# Altium project s-radio.PrjPcb
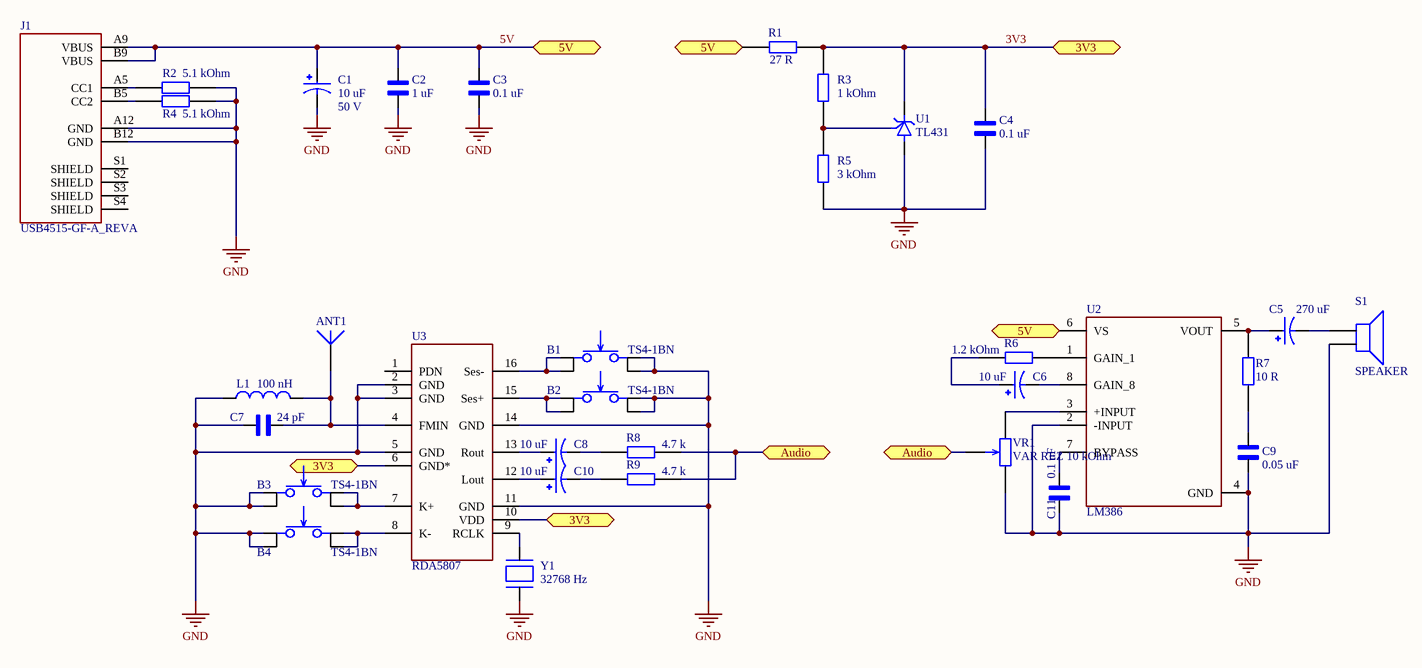
[diagram p0: s-radio_SCHEM.SchDoc]
1 sheet, 33 parts. Net scope: flat (ports and power ports of the same name join across sheets).
Board file: s-radio_PCB.PcbDoc

## Sheet s-radio_SCHEM.SchDoc
size A3; SheetNumber: 1; SheetTotal: 1

### Parts
ANT1  Antenna  [Antenna]  (value not drawn)
B1  TS4-1BN  [TS4-1BN]
B2  TS4-1BN  [TS4-1BN]
B3  TS4-1BN  [TS4-1BN]
B4  TS4-1BN  [TS4-1BN]
C1  value 10 uF  Voltage: 50 V  [К50-35 5x7]  (hidden comment: К50-35)
C2  value 1 uF  [CAP_0603]  (hidden comment: CAP 0603 1 uF)
C3  value 0.1 uF  [CAP_0603]  (hidden comment: CAP 0603 0.1 uF)
C4  value 0.1 uF  [CAP_0603]  (hidden comment: CAP 0603 0.1 uF)
C5  value 270 uF  [CAPPRD350W60D800H1500]  (hidden comment: CAP 270 uF)
C6  value 10 uF  [К50-35 5x7]  (hidden comment: К50-35)
C7  value 24 pF  [CAP_0805]  (hidden comment: CAP 0805 24 pF)
C8  value 10 uF  [К50-35 5x7]  (hidden comment: К50-35)
C9  value 0.05 uF  [CAP_1206]  (hidden comment: CAP 0.05uF 1206)
C10  value 10 uF  [К50-35 5x7]  (hidden comment: К50-35)
C11  value 0.1 uF  [CAP_0603]  (hidden comment: CAP 0603 0.1 uF)
J1  USB4515-GF-A_REVA  [GCT_USB4515-GF-A_REVA]
L1  value 100 nH  [L_0805]  (hidden comment: LQW2BASR10J00L)
R1  value 27 R  [RES_2512]  (hidden comment: RES 27 Ohm)
R2  value 5.1 kOhm  [RES_0603]  (hidden comment: RES 5.1 kOhm)
R3  value 1 kOhm  [RES_0603]  (hidden comment: RES 1 kOhm)
R4  value 5.1 kOhm  [RES_0603]  (hidden comment: RES 5.1 kOhm)
R5  value 3 kOhm  [RES_0603]  (hidden comment: RES 3 kOhm)
R6  value 1.2 kOhm  [RES_0603]  (hidden comment: RES 1.2 kOhm)
R7  value 10 R  [RES_0603]  (hidden comment: RES 10 R)
R8  value 4.7 k  [RES_0805]  (hidden comment: RES 4.7 kOhm)
R9  value 4.7 k  [RES_0805]  (hidden comment: RES 4.7 kOhm)
S1  SPEAKER  [SPEAKER]
U1  TL431  [SOT95P237X112-3N]
U2  LM386  [dip-8]
U3  RDA5807  [SOP-16]
VR1  VAR REZ 10 kOhm  [P160]
Y1  value 32768 Hz  [XTAL_NX3215SA-32.768K-STD-MUA-8]  (hidden comment: NX3215SA-32.768K-STD-MUA-8)

### Ports
3V3 (bidir, see s-radio_SCHEM[2B], s-radio_SCHEM[3B]), 3V3 (bidir, see s-radio_SCHEM[2B], s-radio_SCHEM[5A]), 3V3 (bidir, see s-radio_SCHEM[3B], s-radio_SCHEM[5A]), 5V (bidir, see s-radio_SCHEM[3A]), 5V (bidir, see s-radio_SCHEM[3A], s-radio_SCHEM[5B]), Audio (bidir, see s-radio_SCHEM[4B])

### Nets
GND: B1.3 B1.4 B2.3 B2.4 B3.1 B3.2 B4.1 B4.2 C1.N C2.1 C3.1 C4.1 C7.1 C9.1 C11.2 J1.A12(GND) J1.B12(GND) L1.1 R2.2 R4.2 R5.1 S1.2 U1.2(A) U2.2(-INPUT) U2.4(GND) U3.2(GND) U3.3(GND) U3.5(GND) U3.11(GND) U3.14(GND) VR1.1 Y1.1
3V3: C4.2 R1.2 R3.2 U1.3(C) U3.6(GND*) U3.10(VDD) ; port 3V3
5V: C1.P C2.2 C3.2 J1.A9(VBUS) J1.B9(VBUS) R1.1 U2.6(VS) ; port 5V
NetANT1_1: ANT1.1 C7.2 L1.2 U3.4(FMIN)
NetB1_1: B1.1 B1.2 U3.16(Ses-)
NetB2_1: B2.1 B2.2 U3.15(Ses+)
NetB3_3: B3.3 B3.4 U3.7(K+)
NetB4_3: B4.3 B4.4 U3.8(K-)
NetC5_N: C5.N S1.1
NetC5_P: C5.P R7.2 U2.5(VOUT)
NetC6_N: C6.N U2.8(GAIN_8)
NetC6_P: C6.P R6.1
NetC8_N: C8.N R8.1
NetC8_P: C8.P U3.13(Rout)
NetC9_2: C9.2 R7.1
NetC10_N: C10.N R9.1
NetC10_P: C10.P U3.12(Lout)
NetC11_1: C11.1 U2.7(BYPASS)
NetJ1_A5: J1.A5(CC1) R2.1
NetJ1_B5: J1.B5(CC2) R4.1
NetR3_1: R3.1 R5.2 U1.1(REF)
NetR6_2: R6.2 U2.1(GAIN_1)
NetR8_2: R8.2 R9.2 VR1.2 ; port Audio
NetU2_3: U2.3(+INPUT) VR1.3
NetU3_9: U3.9(RCLK) Y1.2

Not connected (* = marked no-connect by the designer): J1 S1(SHIELD) S2(SHIELD) S3(SHIELD) S4(SHIELD); U3 1(PDN)

### Library data of the parts
C1 C6 C8 C10 = К50-35: 10 uF 50V Aluminum Electrolytic Capacitors Radial; MP: К50-35; Availability: In Stock
  C6 C8 C10: Voltage: 50 V
C5 = CAP 270 uF: 270ÂµF 35V Aluminum Electrolytic Capacitors Radial, Can 8000 Hrs @ 105Â°C; MP: EEUFR1V271L; MF: Panasonic; Package: RADIAL-2 Panasonic; Check_prices: https://www.snapeda.com/parts/EEUFR1V271L/Panasonic/view-part/5793680/?ref=eda; SnapEDA_Link: https://www.snapeda.com/parts/EEUFR1V271L/Panasonic/view-part/5793680/?ref=snap; Digi-Key_Part_Number: P15388CT-ND
C7 = CAP 0805 24 pF: MP: GRM2165C1H240J; Package: 0805; Price: None; Availability: Unavailable; Link: https://www.chipdip.ru/product/grm2165c1h240j
C9 = CAP 0.05uF 1206: Ceramic Capacitor 0.05uf, 50v, X7r, 5%, 1206, Full Reel; MP: 12065C503JAT2A; MF: AVX; Digi-Key_Part_Number: 478-12065C503JAT2ACT-ND; Check_prices: https://www.snapeda.com/parts/12065C503JAT2A/AVX/view-part/2779742/?ref=eda; SnapEDA_Link: https://www.snapeda.com/parts/12065C503JAT2A/AVX/view-part/2779742/?ref=snap; Purchase-URL: https://pricing.snapeda.com/search/part/12065C503JAT2A/?ref=eda; Package: 1206; ComponentLink1Description: New link; ComponentLink1URL: *; Link: https://www.chipdip.ru/product0/9001260404
J1 = USB4515-GF-A_REVA: Type C USB Charging Connector; MF: Global Connector Technology; SnapEDA_Link: https://www.snapeda.com/parts/USB4515-GF-A/Global+Connector+Technology/view-part/?ref=snap; Package: None; Check_prices: https://www.snapeda.com/parts/USB4515-GF-A/Global+Connector+Technology/view-part/?ref=eda; Value: *; Digi-Key_Part_Number: 2073-USB4515-GF-ATR-ND; MP: USB4515-GF-A
L1 = LQW2BASR10J00L: Ind RF Chip Wirewound 100nH 5% 150MHz 65Q-Factor 400mA 0805 Embossed T/R; Package: None; Price: None; MP: LQW2BASR10J00L; Availability: Unavailable; Link: https://www.chipdip.ru/product/lqw2basr10j00l
R1 = RES 27 Ohm: 27 Ohm; MF: {'manufacturer': u'Yageo'}; MP: 0.125Вт 0805 4.7 кОм; Tolerance: 1%; Package: 0805; Price: None; Availability: Unavailable; Link: https://www.chipdip.ru/product/0.125w-0805-4.7-kom-1
R2 R4 = RES 5.1 kOhm: 5.1 kOhm; MF: {'manufacturer': u'Yageo'}; MP: 0.1Вт 0603 5.1 кОм; Tolerance: 5%; Package: 0603; Price: None; Availability: Unavailable; Link: https://www.chipdip.ru/product/0603-5-5k1
R3 = RES 1 kOhm: 1 kOhm; MF: {'manufacturer': u'Yageo'}; MP: 0.1Вт 0603 1 кОм; Tolerance: 5%; Package: 0805; Price: None; Availability: Unavailable; Link: https://www.chipdip.ru/product/0.1w-0603-1-kom-5
R5 = RES 3 kOhm: 3 kOhm; MF: {'manufacturer': u'Yageo'}; MP: 0.1Вт 0603 3 кОм; Tolerance: 1%; Package: 0603; Price: None; Availability: Unavailable; Link: https://www.chipdip.ru/product/0.1w-0603-3-kom-1
R6 = RES 1.2 kOhm: 1.2 kOhm; MF: {'manufacturer': u'Yageo'}; MP: 0.1Вт 0603 1.2 кОм; Tolerance: 5%; Package: 0603; Price: None; Availability: Unavailable
R7 = RES 10 R: 10 Ohm; MF: {'manufacturer': u'Yageo'}; MP: 0.1Вт 0603 10 Ом; Tolerance: 1 %; Package: 0603; Price: None; Availability: Unavailable; Link: https://www.chipdip.ru/product0/8007036517
R8 R9 = RES 4.7 kOhm: 4.7 kOhm; MF: {'manufacturer': u'Yageo'}; MP: 0.125Вт 0805 4.7 кОм; Tolerance: 1%; Package: 0805; Price: None; Availability: Unavailable; Link: https://www.chipdip.ru/product/0.125w-0805-4.7-kom-1
U1 = TL431: Ic, Tl431ilp, Tl431, Tl431a, Tl4 31b, Tl432, Tl432a, Tl432b<Nv; Package: SOT-23; MP: TL431; Price: None; Availability: Unavailable; Value: *
U2 = LM386: MP: LM386N-3/NOPB; Price: None; Package: None; Availability: Unavailable; Value: *
VR1 = VAR REZ 10 kOhm: MF: {'manufacturer': u'Yageo'}; Value: 10 kOhm; Price: None; MP: VAR REZ 10 kOhm; Availability: Unavailable
Y1 = NX3215SA-32.768K-STD-MUA-8: 32.768 kHz Â±20ppm Crystal 12.5pF 70 kOhms 2-SMD, No Lead; MF: NDK America,; Check_prices: https://www.snapeda.com/parts/NX3215SA-32.768K-STD-MUA-8/NDK+America%252C+Inc./view-part/?ref=eda; SnapEDA_Link: https://www.snapeda.com/parts/NX3215SA-32.768K-STD-MUA-8/NDK+America%252C+Inc./view-part/?ref=snap; Availability: In Stock; Package: SMD-2 NDK; Purchase-URL: https://pricing.snapeda.com/search/part/NX3215SA-32.768K-STD-MUA-8/?ref=eda; Price: None; MP: NX3215SA-32.768K-STD-MUA-8; ComponentLink1Description: New link; ComponentLink1URL: *; Link: https://www.chipdip.ru/product0/9000523964
C2 = CAP 0603 1 uF: Package: 0603; Price: None; Availability: Unavailable
C3 C4 C11 = CAP 0603 0.1 uF: Package: 0603; Price: None; Availability: Unavailable; Link: https://www.chipdip.ru/product0/226236018
U3 = RDA5807: PM: RDA5807